# EAGLE design TeilerPlatine (EAGLE 9.6.2)
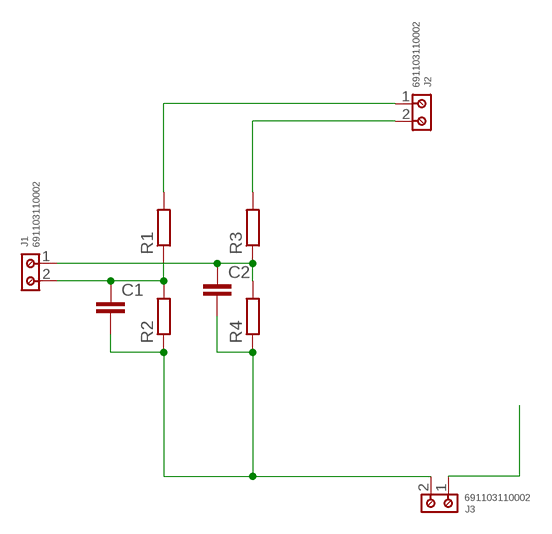
[diagram p0: schematic, sheet 1]

## Parts
C1  C-EU050-025X075  [C050-025X075]
C2  C-EU050-025X075  [C050-025X075]
J1  691103110002  [691103110002]
J2  691103110002  [691103110002]
J3  691103110002  [691103110002]
R1  R-EU_0411/15  [0411/15]
R2  R-EU_0411/15  [0411/15]
R3  R-EU_0411/15  [0411/15]
R4  R-EU_0411/15  [0411/15]

## Nets
N$2: C1.2 C2.2 J3.2 R2.1 R4.1
N$3: J2.1 R1.2
N$4: J2.2 R3.2
N$6: J3.1
N$7: C1.1 J1.2 R1.1 R2.2
N$8: C2.1 J1.1 R3.1 R4.2

## Library data of the parts
C1 C2 = resistor:C-EU: CAPACITOR, European symbol
J1-J3 = Wurth_Connectors_WR-TBL Wire Protector:691103110002: WR-TBL Serie 1031 - 3.50 mm Horiz. Entry Modular KIND PROPERTIES Pitch 3.5 mm MATERIAL PROPERTIES Insulator Material PA66 Insulator Flammability Rating UL94 V-0 Insulator Color Blue Contact Material Brass Contact Plating Copper over Zinc Terminal Screw Material Steel Terminal Screw Plating Zinc Wire Guard Material Stainless Steel GENERAL INFORMATION Operating Temperature -40 up to +105 °C Compliance Lead free / RoHS ELECTRICAL PROPERTIES IR UL 10 A Working Voltage [UL] 125 V (AC) Withstanding Voltage [UL] 1250 V (AC) Contact Resistance 20 mΩ Contact Resistance [UL] 20 mΩ MECHANICAL PROPERTIES Wire Strip Length 5 up to 6 (mm) Screw M2 Solid Wire Section (AWG) 26 to 16 (AWG) Solid Wire Section (Metric) 0.129 to 1.31 (mm²) Stranded Wire Section (AWG) 26 to 16 (AWG) Stranded Wire Section (Metric) 0.129 to 1.31 (mm²) CERTIFICATION UL Approval E315414 PACKAGING PROPERTIES Packaging Box <https://katalog.we-online.com/media/images/v2/o33226v209%20Family_WR-TBL_69110311000x.jpg> Details see: https://katalog.we-online.com/en/em/TBL_3_50_1031_6911031100XX Updated by Ella Wu 2019-11-07 2019(C) Wurth Elektronik; DATASHEET-URL: https://www.we-online.com/catalog/datasheet/691103110002.pdf; IR-UL: 10A; MOUNT: THT; PART-NUMBER: 691103110002; PINS: 2; PITCH: 3.5mm; TYPE: Horizontal; WIRE: 26 to 16 (AWG) 0.129 to 1.31 (mm²); WORKING-VOLTAGE-UL: 125V(AC)
R1-R4 = resistor:R-EU_: RESISTOR, European symbol

## Board
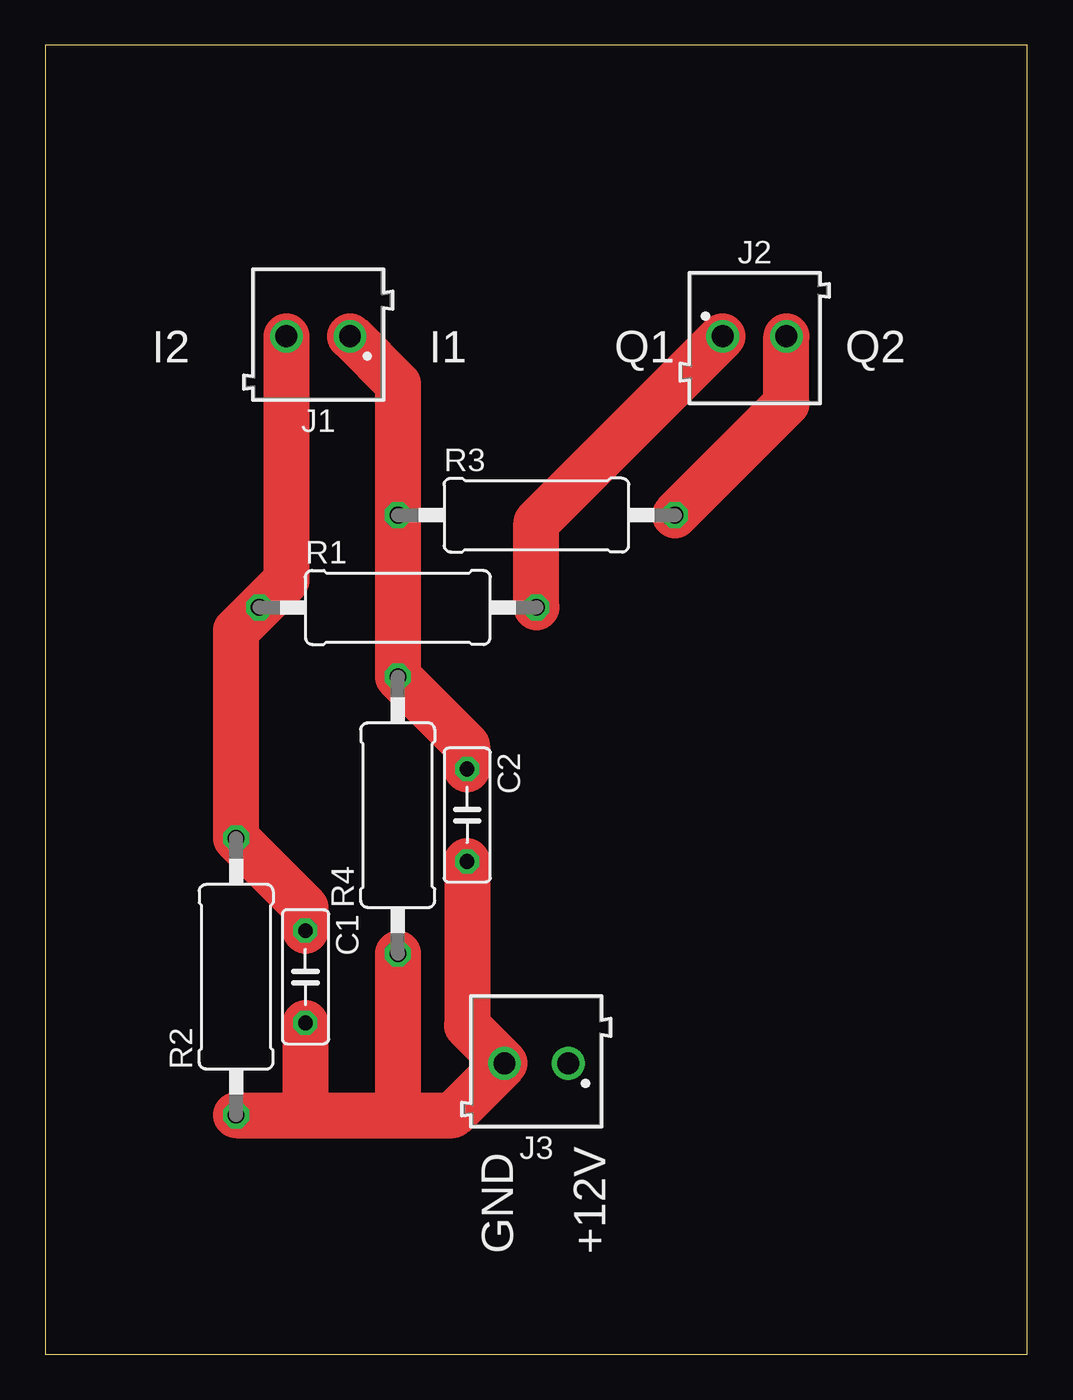
[diagram p1: board, top side]

Size 54 x 72 mm. Coordinates in mm from the lower left corner, seen from the top.
Outline: 0,0 54,0 54,72 0,72 0,0
Copper layers (1*16): Top 0.035mm / dielectric 1.5mm / Bottom 0.035mm
Design rules "default": minimum track width 6mil, minimum drill 0.35mm, track to track 6mil, track to pad 6mil, pad to pad 6mil, via to via 6mil, smd to smd 6mil, copper to edge 40mil, drill to drill 6mil, minimum pad ring 10mil, minimum via ring 8mil, stop-mask expansion 4mil, vias tented up to drill 0mil, thermal gap 10mil

### Footprints (pad centres in the part's own frame; a part is rotated, then mirrored left to right if it is on the bottom)
C050-025X075 = drill 0.813 octagon: 1 -2.54,0; 2 2.54,0
691103110002 = drill 1.2: 1 -1.75,0; 2 1.75,0
0411/15 = drill 0.914 octagon: 1 -7.62,0; 2 7.62,0

### Placement (x,y rotation side)
C1  14.3,20.76 270 top
C2  23.19,29.65 270 top
J1  15,56 180 top
J2  39,56 0 top
J3  27,16 180 top
R1  19.38,41.08 0 top
R2  10.49,20.76 90 top
R3  27,46.16 0 top
R4  19.38,29.65 90 top

### Tracks (layer width: path | path; a pad name or v marks a point on that pad's centre or on a via)
N$2
  Top 2.54: R2.1 14.3,13.14 | 14.3,13.14 19.38,13.14 | 19.38,13.14 22.39,13.14 J3.2 23.19,18.06 C2.2 | C1.2 14.3,13.14 | R4.1 19.38,13.14
N$3
  Top 2.54: R1.2 27,45.75 J2.1
N$4
  Top 2.54: R3.2 40.75,52.29 J2.2
N$7
  Top 2.54: J1.2 13.25,42.57 R1.1 10.49,39.81 R2.2 14.3,24.57 C1.1
N$8
  Top 2.54: C2.1 23.19,33.46 R4.2 R3.1 19.38,53.37 J1.1

### Text on the board
tNames: I2 | I1 | Q1 | Q2 | GND | +12V